# Altium schematic sheet In.SchDoc
size A4; SheetNumber: 2; SheetTotal: 8
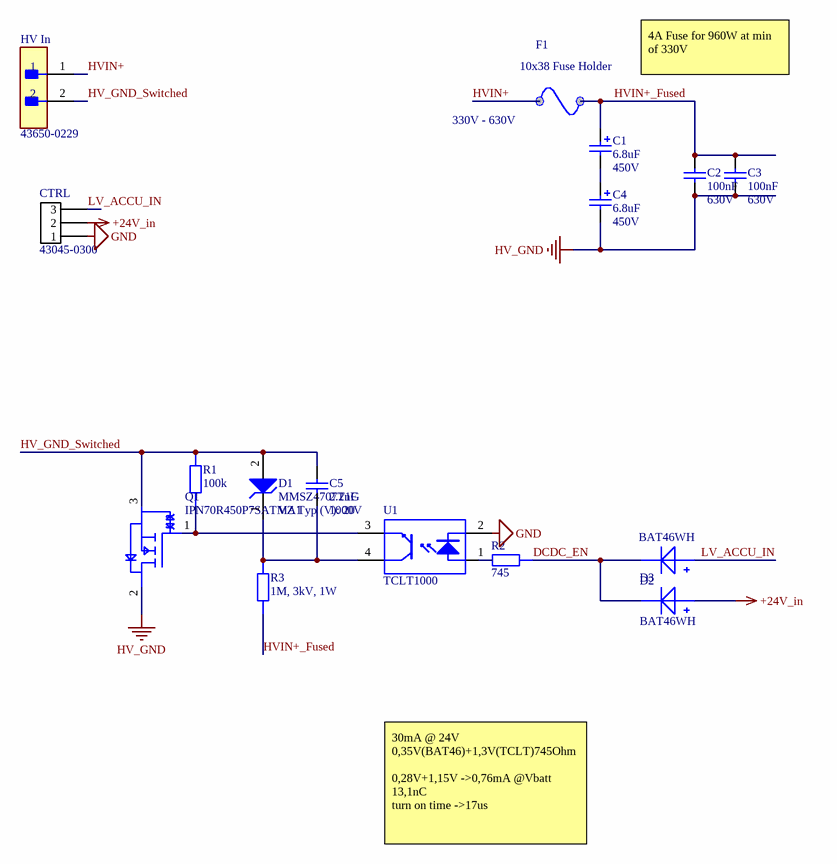
[diagram p0: In.SchDoc]

## Parts
C1  6.8uF  Voltage: 450V  [WCAP-AT1H_D13H20]
C2  Capacitance: 100nF  Voltage: 630V  [WCAP-CSMH_1812_H2]
C3  Capacitance: 100nF  Voltage: 630V  [WCAP-CSMH_1812_H2]
C4  6.8uF  Voltage: 450V  [WCAP-AT1H_D13H20]
C5  Capacitance: 2.2nF  Voltage: 1000V  [WCAP-CSMH_0805_H1.25]
CTRL  43045-0300  [43650-0315]
D1  MMSZ4707T1G  VZ Typ (V): 20  [ONSC-SOD-123-2-425-04_V]
D2  BAT46WH  [DIOM2715X18N]
D3  BAT46WH  [DIOM2715X18N]
F1  10x38 Fuse Holder  [10x38 Fuse]
HV_In  43650-0229  [FP-43650-0229-MFG]
Q1  IPN70R450P7SATMA1  [SOT230P700X180-4L]
R1  value 100k  [STACKPOLE CSR0603]  (hidden comment: SMD Resistor)
R2  value 745  [STACKPOLE CSR0603]  (hidden comment: SMD Resistor)
R3  value 1M, 3kV, 1W  [STACKPOLE CSRN2512]  (hidden comment: CHV2512-FX-1004ELF)
U1  TCLT1000  [VISH-SOP4L-4_V]

## Nets
+24V_in: CTRL.2 D3.1
GND: CTRL.1 U1.2(C)
HV_GND: C2.2 C3.2 C4.2(N) Q1.2
DCDC_EN: D2.2 D3.2 R2.2
HV_GND_Switched: C5.2 D1.2(A) HV_In.2 Q1.3 R1.1
HVIN+: F1.2 HV_In.1
HVIN+_Fused: C1.1(P) C2.1 C3.1 F1.1 R3.2
LV_ACCU_IN: CTRL.3 D2.1
NetC1_2: C1.2(N) C4.1(P)
NetC5_1: C5.1 D1.1(K) R3.1 U1.4(C)
NetQ1_1: Q1.1 R1.2 U1.3(E)
NetR2_1: R2.1 U1.1(A)

## Notes on the sheet
- (near F1) 330V - 630V
- 4A Fuse for 960W at min of 330V
- 30mA @ 24V
  0,35V(BAT46)+1,3V(TCLT)745Ohm
  0,28V+1,15V ->0,76mA @Vbatt
  13,1nC
  turn on time ->17us
- Title:
- Projekt:
- Revision:
- Author:
- Rules:
- Checked by:
- Sheet
- of
- Size:
- A4
- Date:
- Time:

## Library data of the parts
C1 C4 = 860241478002: WCAP-AT1H Aluminum Electrolytic Capacitor, Radial, THT, D13xH20mm, 6.8uF, 450V; Manufacturer: Wurth Elektronik; Rated Voltage: 450VDC; Technical Reference: ATJI2006R8M450DSPACK000; Ripple Current: 240mA; Capacitance Tolerance: +/-20%; Leakage Current: 222.4uA; Endurance: 10000h; Dissipation Factor: 20%; Published Date: October 2020; Operating Temperature: -25 to +105degC; Capacitance: 6.8uF; Packaging: Ammo Pack; Mounting Technology: THT; Manufacturer Part Number: 860241478002; Height: 20mm; Diameter: 13mm; ComponentLink2URL: https://www.we-online.com/catalog/datasheet/860241478002.pdf; ComponentLink2Description: Datasheet; ComponentLink1URL: http://www.we-online.de; ComponentLink1Description: Manufacturer
C2 C3 = 885342211006: WCAP-CSMH Multilayer Ceramic Chip Capacitor, size 1812, X7R Class II, 100nF, 630V; Manufacturer: Wurth Elektronik; Rated Voltage: 630VDC; Insulation Resistance: 1GOhm; Dissipation Factor: 2.5%; Capacitance Tolerance: +/-10%; Technical Reference: X7R1812104K630DFCT10000; ComponentLink1Description: Manufacturer; ComponentLink1URL: http://www.we-online.de; ComponentLink2Description: Datasheet; ComponentLink2URL: https://www.we-online.com/catalog/datasheet/885342211006.pdf; Manufacturer Part Number: 885342211006; Mounting Technology: SMT; Operating Temperature: -55 to +125degC; Published Date: May 2020; Packaging: Tape and Reel; Ceramic Type: X7R Class II; Height: 2mm; Size: 1812
C5 = 885342207016: WCAP-CSMH Multilayer Ceramic Chip Capacitor, size 0805, X7R Class II, 2.2nF, 1000V; Manufacturer: Wurth Elektronik; Rated Voltage: 1000VDC; Insulation Resistance: 10GOhm; Dissipation Factor: 2.5%; Capacitance Tolerance: +/-10%; Technical Reference: X7R0805222KA00DFCT10000; ComponentLink1Description: Manufacturer; ComponentLink1URL: http://www.we-online.de; ComponentLink2Description: Datasheet; ComponentLink2URL: https://www.we-online.com/catalog/datasheet/885342207016.pdf; Manufacturer Part Number: 885342207016; Mounting Technology: SMT; Operating Temperature: -55 to +125degC; Published Date: May 2020; Packaging: Tape and Reel; Ceramic Type: X7R Class II; Height: 1.25mm; Size: 0805
CTRL = MicroFit3.0 3-Pin: Molex Micro-Fit 3.0 3-Pin / 600V / 8.5A
D1 = CMP-1060-00328-1: Zener Voltage Regulator, 500 mW, 2-Pin SOD-123, Pb-Free, Tape and Reel; Manufacturer: On Semiconductor; P Max (W): 0.5; ComponentLink2Description: Datasheet; ComponentLink1Description: Manufacturer URL; PackageReference: SOD-123-2-425-04; PackageVersion: Rev. G, 10/2009; DatasheetVersion: Rev. 9; ComponentLink3URL: http://www.onsemi.com/pub_link/Collateral/425-04.PDF; ComponentLink2URL: http://www.onsemi.com/pub_link/Collateral/MMSZ4678T1-D.PDF; PackageDescription: 2-Pin SOD, Body 1.6 x 2.69 mm; Mounting Technology: Surface Mount; Packing: Tape and Reel; ComponentLink1URL: http://www.onsemi.com/; PartNumber: MMSZ4707T1G; ComponentLink3Description: Package Specification; RoHS: Pb-Free
HV_In = CMP-04776-000041-1: CONN HEADER VERT 2POS 3MM; Manufacturer: Molex; Voltage Rating: 600V; Conn Orientation: Vertical; Conn Gender: Male; Number Of Contacts: 2; Current Rating: 8.5A; ComponentLink2URL: https://www.molex.com/webdocs/datasheets/pdf/en-us/0436500229_PCB_HEADERS.pdf; ComponentLink2Description: Datasheet; Mouser Description: Headers & Wire Housings MicroFit 3.0 SR V TH Peg 30Au 2Ckt; Category: Conn; Height: 10.15mm; Contact Material: Gold,Nickel; Octopart: https://octopart.com/43650-0229-molex-7652326; Manufacturer Part Number: 43650-0229; Device Class L3: unset; Digikey Description: CONN HEADER VERT 2POS 3MM; Temperature Range Low: -40°C; Temperature Range High: +105°C; Pitch: 3mm; Package: 0; RoHS: TRUE; Device Class L1: Connectors; Lead Free: Yes; Temperature: -40°C to +105°C; Number Of Rows: 1; Automotive: No; Device Class L2: Headers and Wire Housings; Footprint Url: https://www.molex.com/pdm_docs/sd/436500229_sd.pdf
Q1 = IPN70R450P7SATMA1: IPN70R450P7S Series 700 V 10 A 7.1 W CoolMOS P7 Power Transistor - PG-SOT-223; Manufacturer: Infineon; Max Dual Supply Voltage: 700V; Supplier 1: Digi-Key; Manufacturer Part Number: IPN70R450P7SATMA1; RoHS: Yes; Category: Power Management ICs; Stock 1: 595; Pricing 1: 1=1,00000, 10=0,89700, 100=0,69970, 500=0,57798, 1000=0,50700 (USD); Mount: Surface Mount; Case/Package: SOT-223; Min Operating Temperature: -40°C; Max Operating Temperature: 150°C; Drain to Source Voltage (Vdss): 700V; Lead Free: Contains Lead; Halogen Free: Halogen Free; RoHS Compliant: Yes; ComponentLink1URL: https://www.infineon.com/dgdl/Infineon-IPN70R450P7S-DS-v02_00-EN.pdf?fileId=5546d4625f2e26bc015f526728366b78&src-supplier=Digi-Key; ComponentLink1Description: https://www.infineon.com/dgdl/Infineon-IPN70R450P7S-DS-v02_00-EN.pdf?fileId=5546d4625f2e26bc015f526728366b78&src-supplier=Digi-Key
R1-R3 = SMD Resistor: Resistor with multiple footprints
U1 = CMP-2000-07234-1: Optocoupler, Phototransistor Output, VCEO 70 V, -55 to 100 degC, 4-Pin SOP (SOP4L), RoHS, Tape and Reel; Manufacturer: Vishay/Semiconductor; Maximum Collector Emitter Voltage: 70V; Input Type: DC; Maximum Reverse Voltage: 6V; Maximum Collector Emitter Saturation Voltage: 300mV; Number of Channels per Chip: 1; Maximum Collector Current: 50mA; Maximum Power Dissipation: 250mW; Maximum Forward Voltage: 1.6V; Maximum Input Current: 60mA; Typical Forward Voltage: 1.25V; Minimum Isolation Voltage: 5000Vrms; Maximum Current Transfer Ratio @ Current: 600%; Manufacturer URL: http://www.vishay.com/; Package: 4SOP; Mounting Technology: SurfaceMount; Category: TransistorandPhotovoltaicOutputPhotoCouplers; Datasheet URL: http://www.vishay.com/docs/83515/tclt1000.pdf; Output Type: DC; Operating Temperature: -40to100°C; Package Description: 4-Pin Small Outline Package Integrated Circuit, Body 4.1 x 7.5 mm, Pitch 2.54 mm; Datasheet Version: Rev. 2.9, 12/2015; Package Reference: SOP4L; Packaging: Tape&Reel
D2 D3 = BAT46WH: Supplier 1: Mouser